# Altium schematic sheet DB10011_Controller.SchDoc: uController
size A3; Engineer: Danny Bokma; Revision: V0.3; SheetNumber: 2; SheetTotal: 7
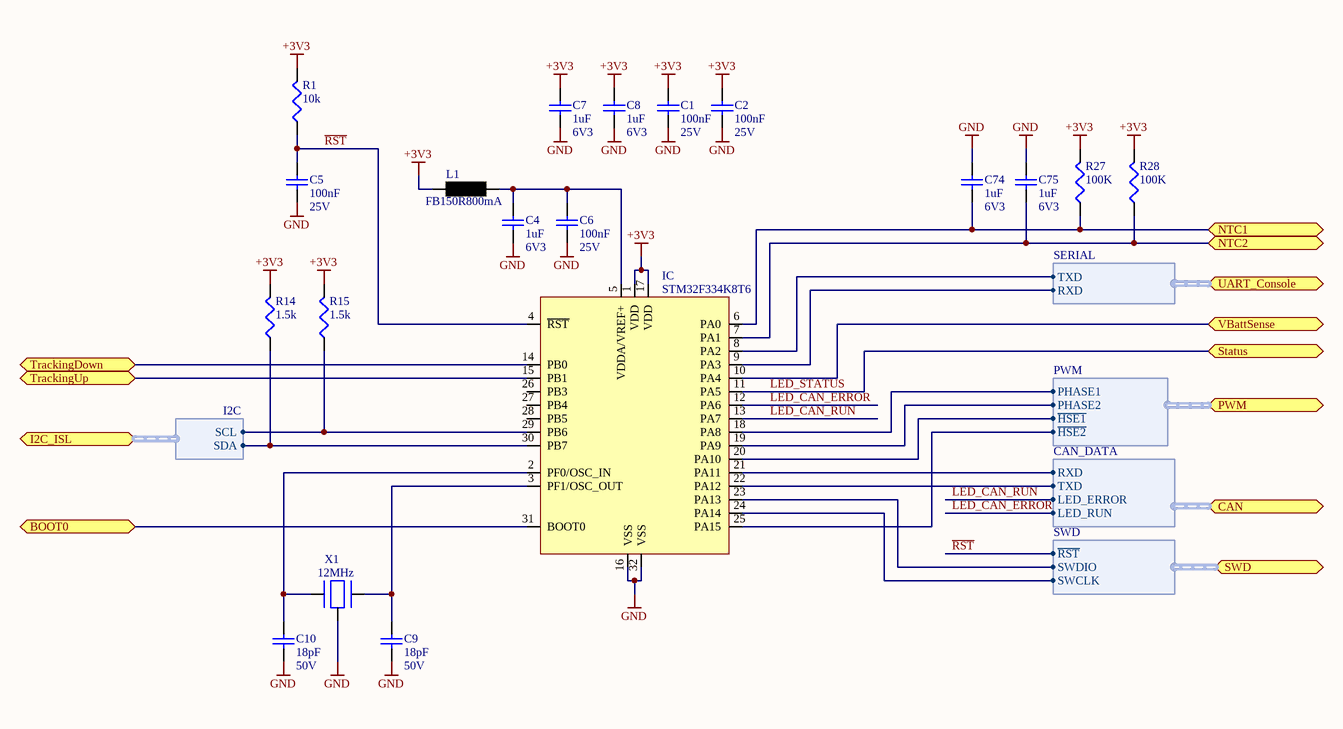
[diagram p0: DB10011_Controller.SchDoc]

## Parts
C1  100nF  Voltage Rating: 25V  [C0402]
C2  100nF  Voltage Rating: 25V  [C0402]
C4  1uF  Voltage Rating: 6V3  [C0402]
C5  100nF  Voltage Rating: 25V  [C0402]
C6  100nF  Voltage Rating: 25V  [C0402]
C7  1uF  Voltage Rating: 6V3  [C0402]
C8  1uF  Voltage Rating: 6V3  [C0402]
C9  18pF  Voltage Rating: 50V  [C0402]
C10  18pF  Voltage Rating: 50V  [C0402]
C74  1uF  Voltage Rating: 6V3  [C0402]
C75  1uF  Voltage Rating: 6V3  [C0402]
IC  STM32F334K8T6  [LQFP32]
L1  FB150R800mA  [0805]
R1  10k  [0402]
R14  1.5k  [0402]
R15  1.5k  [0402]
R27  100K  [0402]
R28  100K  [0402]
X1  12MHz  [7M]

## Ports
BOOT0, CAN (harness CAN_DATA), I2C_ISL (harness I2C), NTC1, NTC2, PWM (harness PWM), Status, SWD (harness SWD), TrackingDown, TrackingUp, UART_Console (harness SERIAL), VBattSense

## Harnesses
CAN_DATA: RXD, TXD, LED_ERROR, LED_RUN
I2C: SDA, SCL
SWD: SWCLK, SWDIO, ~{RST}
SERIAL: RXD, TXD
PWM: PHASE2, PHASE1, ~{HSE1}, ~{HSE2}

## Nets
+3V3: C1.2 C2.2 C7.2 C8.2 IC.1(VDD) IC.17(VDD) L1.1 R1.2 R14.2 R15.2 R27.2 R28.2
GND: C1.1 C2.1 C4.1 C5.1 C6.1 C7.1 C8.1 C9.1 C10.1 C74.2 C75.2 IC.16(VSS) IC.32(VSS) X1.0
BOOT0: IC.31(BOOT0) ; port BOOT0
LED_CAN_ERROR: IC.12(PA6) ; port CAN.LED_RUN
LED_CAN_RUN: IC.13(PA7) ; port CAN.LED_ERROR
LED_STATUS: IC.11(PA5) ; port Status
NTC1: C74.1 IC.6(PA0) R27.1 ; port NTC1
NTC2: C75.1 IC.7(PA1) R28.1 ; port NTC2
~{RST}: C5.2 IC.4(~{RST}) R1.1 ; port SWD.~{RST}
TrackingDown: IC.14(PB0) ; port TrackingDown
TrackingUp: IC.15(PB1) ; port TrackingUp
VBattSense: IC.10(PA4) ; port VBattSense
NetC4_2: C4.2 C6.2 IC.5(VDDA/VREF+) L1.2
NetC9_2: C9.2 IC.3(PF1/OSC_OUT) X1.2
NetC10_2: C10.2 IC.2(PF0/OSC_IN) X1.1
NetIC_8: IC.8(PA2) ; port UART_Console.TXD
NetIC_9: IC.9(PA3) ; port UART_Console.RXD
NetIC_18: IC.18(PA8) ; port PWM.PHASE1
NetIC_19: IC.19(PA9) ; port PWM.PHASE2
NetIC_20: IC.20(PA10) ; port PWM.~{HSE1}
NetIC_21: IC.21(PA11) ; port CAN.RXD
NetIC_22: IC.22(PA12) ; port CAN.TXD
NetIC_23: IC.23(PA13) ; port SWD.SWDIO
NetIC_24: IC.24(PA14) ; port SWD.SWCLK
NetIC_25: IC.25(PA15) ; port PWM.~{HSE2}
NetIC_29: IC.29(PB6) R15.1 ; port I2C_ISL.SCL
NetIC_30: IC.30(PB7) R14.1 ; port I2C_ISL.SDA

Not connected (* = marked no-connect by the designer): IC 26(PB3) 27(PB4) 28(PB5)

## Notes on the sheet
- Title
- Size:
- Date:
- A3
- Number:
- Time:
- Revision:
- Sheet
- of
- File:

## Library data of the parts
C1 C2 C5 C6 = 100nF/0402/CER/25V: Capacitor, 100nF, 25V, X7R; Capacitance Tolerance: 10nF; Capacitor Case Style: 0402; Brand Number: GRM155R71E104KE14D; Brand: MULTICOMP; Dielectric Characteristic: X7R; Capacitance: 100nF; Temperature Range: -55 to +125 C; Price: 0,0225; Order Code Supplier: 2456106; Supplier: Farnell
C4 C7 C8 C74 C75 = 1uF/0402/CER/6.3V: Capacitor, 1uF, 6.3V, X5R; Capacitance Tolerance: ± 10%; Capacitor Case Style: 0402; Brand Number: 04026D105KAT2A; Brand: AVX; Dielectric Characteristic: X5R; Capacitance: 1uF; Temperature Range: -55°C to +85°C; Price: 0,0874; Order Code Supplier: 1327658; Supplier: Farnell
C9 C10 = 18pF/0402/CER/50V: Capacitor, 18pF, 50V, NP0; Capacitance Tolerance: ± 5%; Capacitor Case Style: 0402; Brand Number: GRM1555C1H180JA01D; Brand: MURATA; Dielectric Characteristic: NP0; Capacitance: 18pF; Temperature Range: -55°C to 125°C; Price: 0,0177; Order Code Supplier: 1828876; Supplier: Farnell
IC = STM32F334K8T6: MCU, 32BIT CORTEX-M3, 72MHz, HRTIM; Brand: STM; Brand Number: STM32F334K8T6; Supplier: Mouser; Order Code Supplier: 511-STM32F334K8T6
L1 = LI0805H151R: Ferrite, 150R, 0.8Adc, 100MHz; Brand: LAIRD TECHNOLOGIES; Brand Number: LI0805H151R-10; DC Current: 1.3A; DC Resistance: 0.15Ohm; Case Style: 0805; Inductance: *; Order Code Supplier: 2292441; Price: 0,0407; Q Factor: *; Supplier: Farnell; Temperature Range: -40°C to +125°C
R1 = 10k/0402/0063W/50V: Resistor, 10k, 0.1%, 0.0625W, 50V, 100PPM, 0402; Brand: VISHAY DRALORIC; Brand Number: CRCW040210K0FKED; Power Rating: 0.063W; Case Style: 0402; Order Code Supplier: 2121730; Price: 0,0005; Resistance: 10k; Supplier: Farnell; Temperature Coefficient: ± 100PPM; Temperature Range: -55°C to +125°C; Voltage Rating: 50V
R14 R15 = 1.5k/0402/0063W/50V: Resistor, 1.5k, 0.1%, 0.0625W, 50V, 100PPM, 0402; Brand: VISHAY DRALORIC; Brand Number: CRCW04021K50FKED; Power Rating: 0.063W; Case Style: 0402; Order Code Supplier: 2121624; Price: 0,0054; Resistance: 1.5k; Supplier: Farnell; Temperature Coefficient: ± 100PPM; Temperature Range: -55°C to +125°C; Voltage Rating: 50V
R27 R28 = 100k/0402/0063W/50V: Resistor, 100k, 0.1%, 0.0625W, 50V, 100PPM, 0402; Brand: VISHAY DRALORIC; Brand Number: CRCW0402100KFKED; Power Rating: 0.063W; Case Style: 0402; Order Code Supplier: 2121857; Price: 0,0004; Resistance: 100K; Supplier: Farnell; Temperature Coefficient: ± 100PPM; Temperature Range: -55°C to +125°C; Voltage Rating: 50V
X1 = 7M-12.000MAAJ-T: CRYSTAL, 12MHz,18PF CL, 3.2X2.5MM SMT; Brand: TXC; Order Code Supplier: 1842056; Price: 1,45; Supplier: Farnell; Brand Number: 7M-12.000MAAJ-T